# Altium schematic sheet SCH_03_Bandpass_Filter.SchDoc
size A4; SheetNumber: 7; SheetTotal: 9; SPICEModelCacheSWFGVLDN: <root> / <DocumentId>SWFGVLDN</DocumentId> / <CacheFrame Number="0"> / <Model Name="0603_885012206095_100nf" Kind="CKT"> / <Text>******* / .subckt 0603_885012206095_100nF 1 2 / Rser 1 3 0.0157659152881 / Lser 2 4 3.10171966E-10 / C1 3 4 0.0000001 / Rpar 3 4 5000000000 / .ends 0603_885012206095_100nF</Text> / </Model> / <Model Name="0603_885012106031_10uf" Kind="CKT"> / <Text>******* / .subckt 0603_885012106031_10uF 1 2 / Rser 1 3 0.0105 / Lser 2 4 0.0000000008 / C1 3 4 0.00001 / Rpar 3 4 10000000 / .ends 0603_885012106031_10uF</Text> / </Model> / </CacheFrame> / </root>
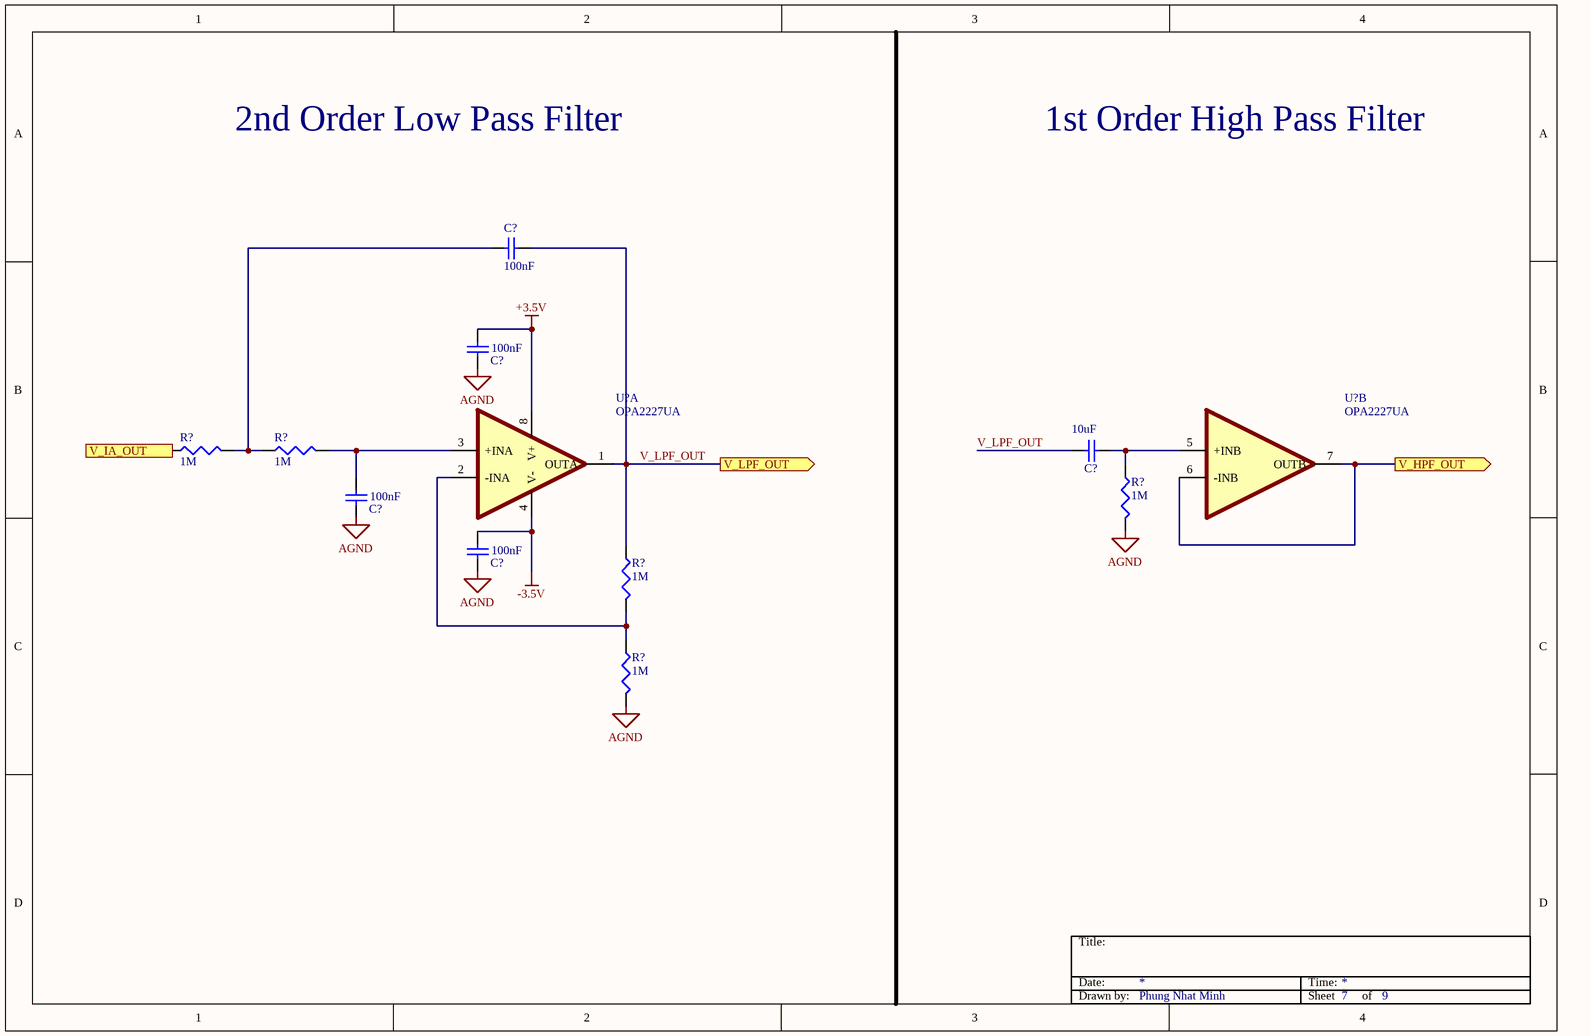
[diagram p0: SCH_03_Bandpass_Filter.SchDoc]

## Parts
(Parts that share a designator on the sheet are numbered #1, #2 ... from top to bottom, then left to right.)
C?#1  100nF  [WCAP-CSGP_0603_L1.6W0.8H0.8_Reflow]
C?#2  100nF  [WCAP-CSGP_0603_L1.6W0.8H0.8_Reflow]
C?#3  10uF  [WCAP-CSGP_0603_L1.6W0.8H0.8_Reflow]
C?#4  100nF  [WCAP-CSGP_0603_L1.6W0.8H0.8_Reflow]
C?#5  100nF  [WCAP-CSGP_0603_L1.6W0.8H0.8_Reflow]
R?#1  1M  [WRIS-PSMB_0603_L1.6W0.8H0.35]
R?#2  1M  [WRIS-PSMB_0603_L1.6W0.8H0.35]
R?#3  1M  [WRIS-PSMB_0603_L1.6W0.8H0.35]
R?#4  1M  [WRIS-PSMB_0603_L1.6W0.8H0.35]
R?#5  1M  [WRIS-PSMB_0603_L1.6W0.8H0.35]
U?#1  OPA2227UA  [SOIC127P599X175-8N]  (part A of 2)
U?#2  OPA2227UA  [SOIC127P599X175-8N]  (part B of 2)

## Ports
V_HPF_OUT (out, see Schematic_Top[2B]), V_IA_OUT (in, see Schematic_Top[2A], SCH_02_Instrumentation_Amplifier[4B]), V_LPF_OUT (out, see Schematic_Top[2B])

## Nets
+3.5V: C?#2.2 U?#1.8(V+)
-3.5V: C?#5.2 U?#1.4(V-)
AGND: C?#2.1 C?#4.1 C?#5.1 R?#3.2 R?#5.2
V_HPF_OUT: U?#2.6(-INB) U?#2.7(OUTB) ; port V_HPF_OUT
V_LPF_OUT: C?#1.1 C?#3.1 R?#4.1 U?#1.1(OUTA) ; port V_LPF_OUT
NetC?#1_2: C?#1.2 R?#1.2 R?#2.1
NetC?#3_2: C?#3.2 R?#3.1 U?#2.5(+INB)
NetC?#4_2: C?#4.2 R?#2.2 U?#1.3(+INA)
NetR?#4_2: R?#4.2 R?#5.1 U?#1.2(-INA)

Not connected (* = marked no-connect by the designer): R?#1 1

## Notes on the sheet
- 2nd Order Low Pass Filter
- 1st Order High Pass Filter
- Title:
- Date:
- Time:
- Drawn by:
- Phung Nhat Minh
- Sheet
- of

## Library data of the parts
C?#1 C?#2 C?#4 C?#5 = 885012206095: WCAP-CSGP Multilayer Ceramic Chip Capacitor, General Purpose, size 0603, X7R, 100nF, 50VDC; Manufacturer: Wurth Elektronik; Case/Size Code: 0603; Capacitance Tolerance: +/-10%; Dissipation Factor: 3%; Insulation Resistance: 5GOhm; Rated Voltage (DC): 50V; Technical Reference: X7R0603104K050DFCT10000; Manufacturer Part Number: 885012206095; Category: Multilayer Ceramic Chip Capacitors; Match Code: WCAP-CSGP; ComponentLink1Description: Website Link; ComponentLink1URL: https://www.we-online.com/redexpert/article/885012206095?ad; ComponentLink2Description: Datasheet Link; ComponentLink2URL: https://www.we-online.com/redexpert/spec/885012206095?ad; Mount: Surface Mount; Operating Temperature Max: 125°C; Operating Temperature Min: -55°C; Packaging: Tape and Reel; Length: 1.6mm; Width: 0.8mm; Height: 0.8mm; Capacitance: 100nF; Ceramic Type: X7R
C?#3 = 885012106031: WCAP-CSGP Multilayer Ceramic Chip Capacitor, General Purpose, size 0603, X5R, 10uF, 25VDC; Manufacturer: Wurth Elektronik; Case/Size Code: 0603; Capacitance Tolerance: +/20%; Dissipation Factor: 20%; Insulation Resistance: 0.01GOhm; Rated Voltage (DC): 25V; Technical Reference: X5R0603106M025DFCT10000; Manufacturer Part Number: 885012106031; Category: Multilayer Ceramic Chip Capacitors; Match Code: WCAP-CSGP; ComponentLink1Description: Website Link; ComponentLink1URL: https://www.we-online.com/redexpert/article/885012106031?ad; ComponentLink2Description: Datasheet Link; ComponentLink2URL: https://www.we-online.com/redexpert/spec/885012106031?ad; Mount: Surface Mount; Operating Temperature Max: 85°C; Operating Temperature Min: -55°C; Packaging: Tape and Reel; Length: 1.6mm; Width: 0.8mm; Height: 0.8mm; Capacitance: 10uF; Ceramic Type: X5R
R?#1-R?#5 = 580060716001: WRIS-PSMB Metal Plate Resistor, SMT, size 0603, 0.33W, 5mΩ, +/-1%; Manufacturer: Wurth Elektronik; Case/Size Code: 0603; Rated Current: 8.12A; Technical Reference: MB0603R005F103KAATP0000; Temperature Coefficient of Resistance: +/-100ppm/°C; Manufacturer Part Number: 580060716001; Category: Metal Plate Resistors; Match Code: WRIS-PSMB; ComponentLink1Description: Website Link; ComponentLink1URL: https://www.we-online.com/redexpert/article/580060716001?ad; ComponentLink2Description: Datasheet Link; ComponentLink2URL: https://www.we-online.com/redexpert/spec/580060716001?ad; Mount: Surface Mount; Operating Temperature Max: 155°C; Operating Temperature Min: -55°C; Packaging: Tape and Reel; Length: 1.6mm; Width: 0.8mm; Height: 0.35mm; Rated Power: 0.33W; Resistance: 5mΩ; Resistance Tolerance: +/-1%
U?#1 U?#2 = OPA2227UA: Package: None; Price: None; Value: *; MP: OPA2227UA; Availability: Unavailable